# EAGLE design AVR-Stick-v12 (EAGLE 5.10)
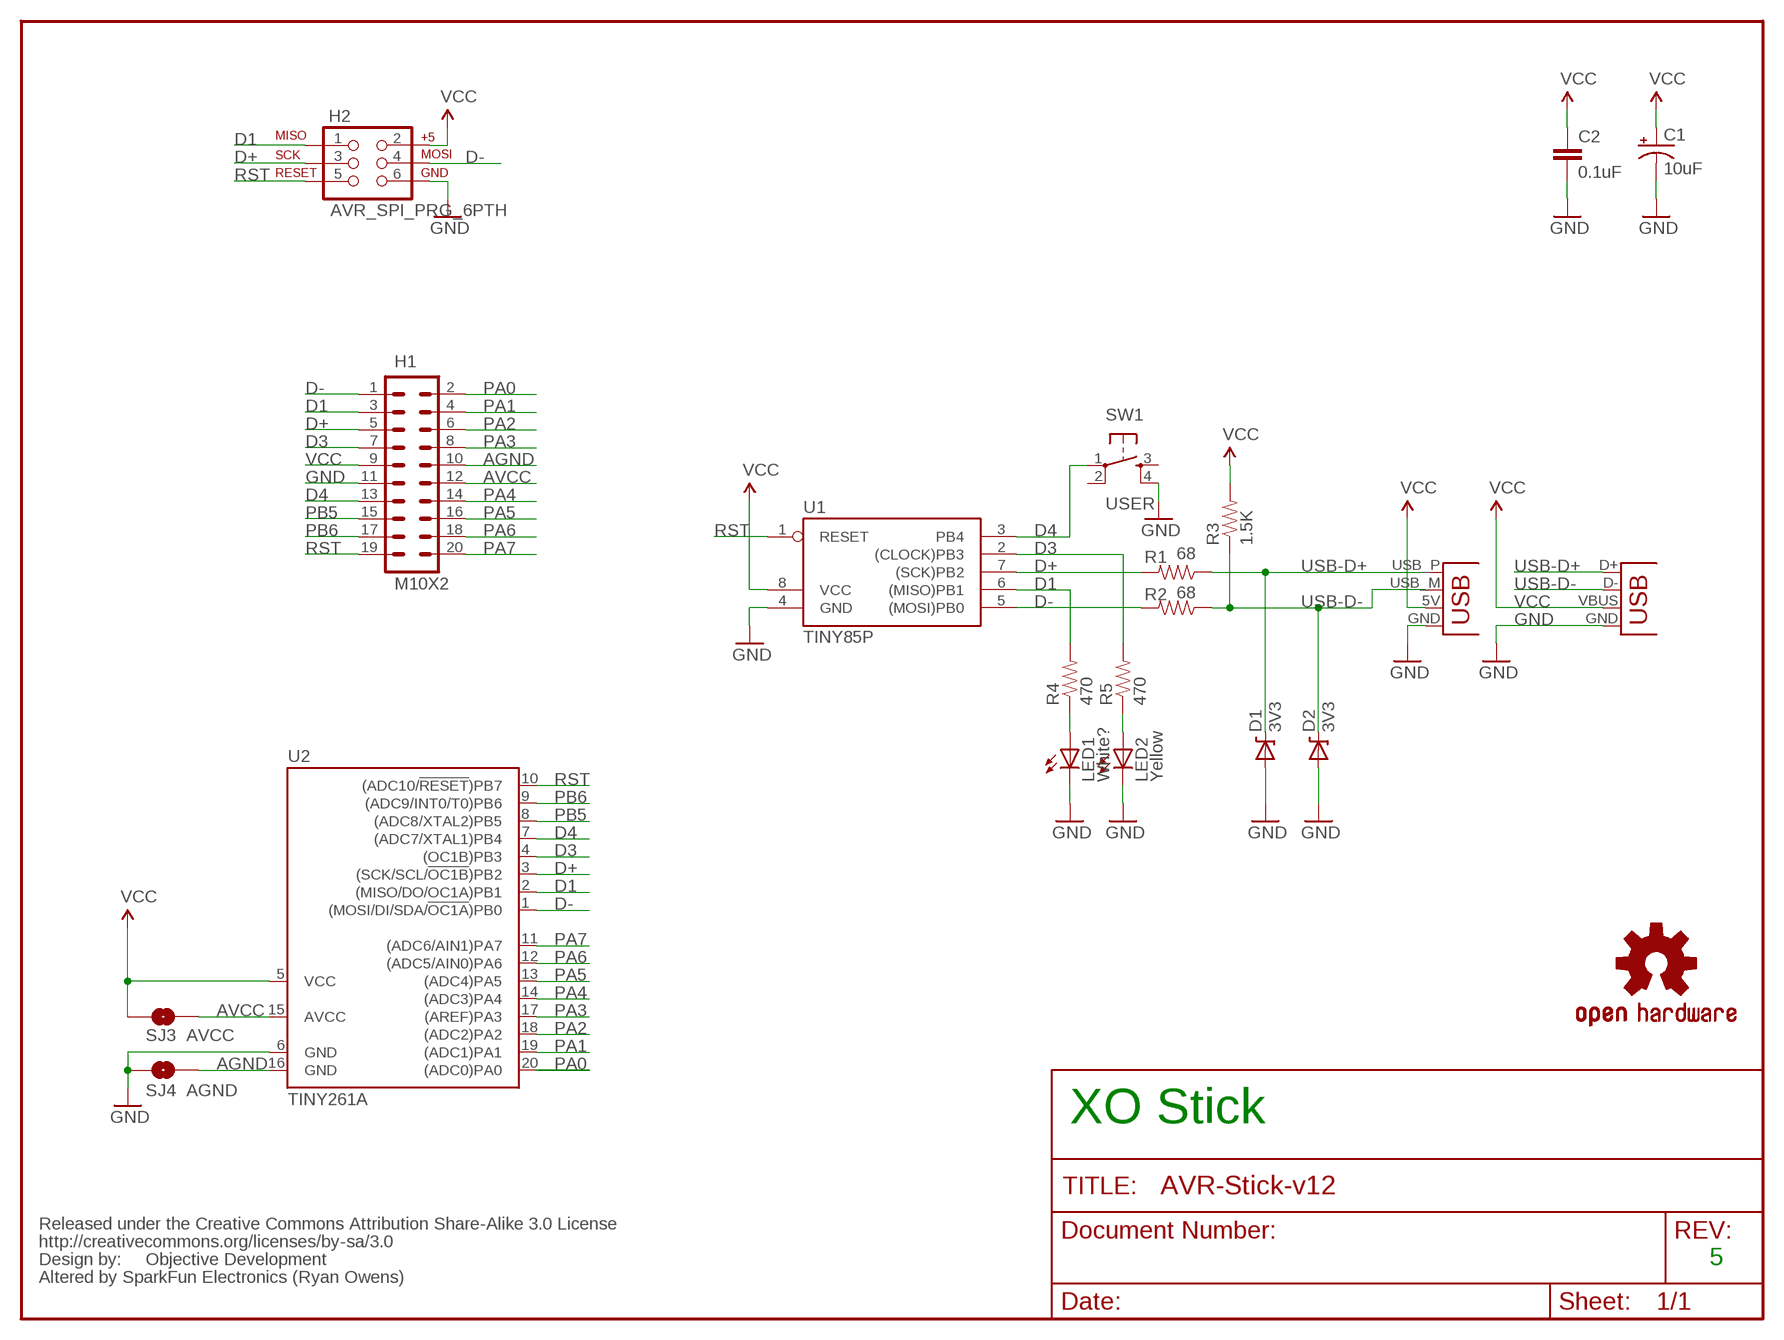
[diagram p0: schematic, sheet 1]

## Parts
C1  10uF  CAP_POLPTH2  [CPOL-RADIAL-10UF-25V]
C2  0.1uF  CAPPTH  [CAP-PTH-SMALL]
D1  3V3  DIODE-ZENERPTH  [DIODE-ZENER]
D2  3V3  DIODE-ZENERPTH  [DIODE-ZENER]
H1  M10X2  [2X10]
H2  AVR_SPI_PRG_6PTH  [2X3]
LED1  White?  LED3MM  [LED3MM]
LED2  Yellow  LED3MM  [LED3MM]
R1  68  RESISTORAXIAL-0.3  [AXIAL-0.3]
R2  68  RESISTORAXIAL-0.3  [AXIAL-0.3]
R3  1.5K  RESISTORAXIAL-0.3  [AXIAL-0.3]
R4  470  RESISTORAXIAL-0.3  [AXIAL-0.3]
R5  470  RESISTORAXIAL-0.3  [AXIAL-0.3]
SJ3  AVCC  SOLDERJUMPERTRACE  [SJ_2S-TRACE]
SJ4  AGND  SOLDERJUMPERTRACE  [SJ_2S-TRACE]
SW1  USER  TAC_SWITCHPTH  [TACTILE-PTH]
U1  TINY85P  [DIL08]
U2  TINY261A  TINY26LP  [DIL20]
U$1  OSHW-LOGOM  [OSHW-LOGO-M]
U$4  CREATIVE_COMMONS  [CREATIVE_COMMONS]
X1  USBPCB  [USB-A-PCB]
X2  USBPTH  [USB-B-PTH]

## Nets
AGND: H1.10 SJ4.2 U2.16(GND)
AVCC: H1.12 SJ3.2 U2.15(AVCC)
D1: H1.3 H2.1 R4.P$2 U1.6((MISO)PB1) U2.2((MISO/DO/OC1A)PB1)
D3: H1.7 R5.P$2 U1.2((CLOCK)PB3) U2.4((OC1B)PB3)
D4: H1.13 SW1.1 U1.3(PB4) U2.7((ADC7/XTAL1)PB4)
D+: H1.5 H2.3 R1.P$2 U1.7((SCK)PB2) U2.3((SCK/SCL/!OC1B!)PB2)
D-: H1.1 H2.4 R2.P$2 U1.5((MOSI)PB0) U2.1((MOSI/DI/SDA/!OC1A!)PB0)
GND: C1.2(-) C2.2 D1.P$2(A) D2.P$2(A) H1.11 H2.6 LED1.K(C) LED2.K(C) SJ4.1 SW1.4 U1.4(GND) U2.6(GND) X1.GND X2.GND
N$7: LED1.A R4.P$1
N$9: LED2.A R5.P$1
PA0: H1.2 U2.20((ADC0)PA0)
PA1: H1.4 U2.19((ADC1)PA1)
PA2: H1.6 U2.18((ADC2)PA2)
PA3: H1.8 U2.17((AREF)PA3)
PA4: H1.14 U2.14((ADC3)PA4)
PA5: H1.16 U2.13((ADC4)PA5)
PA6: H1.18 U2.12((ADC5/AIN0)PA6)
PA7: H1.20 U2.11((ADC6/AIN1)PA7)
PB5: H1.15 U2.8((ADC8/XTAL2)PB5)
PB6: H1.17 U2.9((ADC9/INT0/T0)PB6)
RST: H1.19 H2.5 U1.1(RESET) U2.10((ADC10/!RESET!)PB7)
USB-D+: D1.P$1(C) R1.P$1 X1.USB_P(D+) X2.D+
USB-D-: D2.P$1(C) R2.P$1 R3.P$1 X1.USB_M(D-) X2.D-
VCC: C1.1(+) C2.1 H1.9 H2.2 R3.P$2 SJ3.1 U1.8(VCC) U2.5(VCC) X1.5V(VBUS) X2.VBUS
Unconnected: SW1.2 SW1.3

## Notes on the sheet
- XO Stick
- Objective Development | 5
- Altered by SparkFun Electronics (Ryan Owens)

## Library data of the parts
C1 = SparkFun:CAP_POL: Capacitor Polarized These are standard SMD and PTH capacitors. Normally 10uF, 47uF, and 100uF in electrolytic and tantalum varieties. Always verify the external diameter of the through hole cap, it varies with capacity, voltage, and manufacturer. The EIA devices should be standard.
C2 = SparkFun:CAP: Capacitor Standard 0603 ceramic capacitor, and 0.1" leaded capacitor.
D1 D2 = SparkFun:DIODE-ZENER: Zener Diode Production Part - 8199 3.4V Zener Voltage
H1 = SparkFun:M10X2: This was SPECIALLY designed to be used with our Graphic LCD Backpack. Be sure you want to use this! It is not only staggered on each line of header holes, but IT IS ALSO offset of the center point of the top and bottom lines by 5 mil. This causes the headers to lock into place on the "standard" footprint on the LCD screen. The extra squares on the tdocu layer are there simply to reference other pins (if you were to actually populate a longer header than ten long - this is what we do with the backpacks).
H2 = SparkFun:AVR_SPI_PRG_6: AVR ISP 6 Pin This is the reduced ISP connector for AVR programming. Common on Arduino. This footprint will take up less PCB space and can be used with a 10-pin to 6-pin adapter such as SKU: BOB-08508
LED1 LED2 = SparkFun:LED: LEDs Standard schematic elements and footprints for 5mm, 3mm, 1206, and 0603 sized LEDs. 5mm - Spark Fun Electronics SKU : COM-00529 (and others)
R1-R5 = SparkFun:RESISTOR: Resistor Basic schematic elements and footprints for 0603, 1206, and PTH resistors.
SJ3 SJ4 = SparkFun:SOLDERJUMPER: Solder Jumper Standard SMD solder jumper. Used to automate production. Two varients : Normally Open and Normally Closed are the same, but have different paste layers. NC will have a large amount of paste and should jumper during reflow.
SW1 = SparkFun:TAC_SWITCH: Momentary Switch Button commonly used for reset or general input. Spark Fun Electronics SKU : COM-00097
U1 = atmel:TINY85: MICROCONTROLLER 1K ROM 128 bytes RAM 128 bytes EEPROM
U2 = atmel:TINY26*: 8-bit AVR Microcontroller with 2K Bytes Flash Source: http://www.atmel.com .. doc1477.pdf
U$1 = SparkFun:OSHW-LOGO: Open Source Hardware Logo This logo indicates the piece of hardware it is found on incorporates a OSHW license and/or adheres to the definition of open source hardware found here: http://freedomdefined.org/OSHW
U$4 = SparkFun:CREATIVE_COMMONS
X1 X2 = SparkFun:USB: USB Connectors USB-B-PTH is fully proven SKU : PRT-00139 USB-miniB is fully proven SKU : PRT-00587 USB-A-PCB is untested. USB-A-H is throughly reviewed, but untested. Spark Fun Electronics SKU : PRT-00437 USB-B-SMT is throughly reviewed, but untested. Needs silkscreen touching up. USB-A-S has not been used/tested USB-MB-H has not been used/tested

## Board
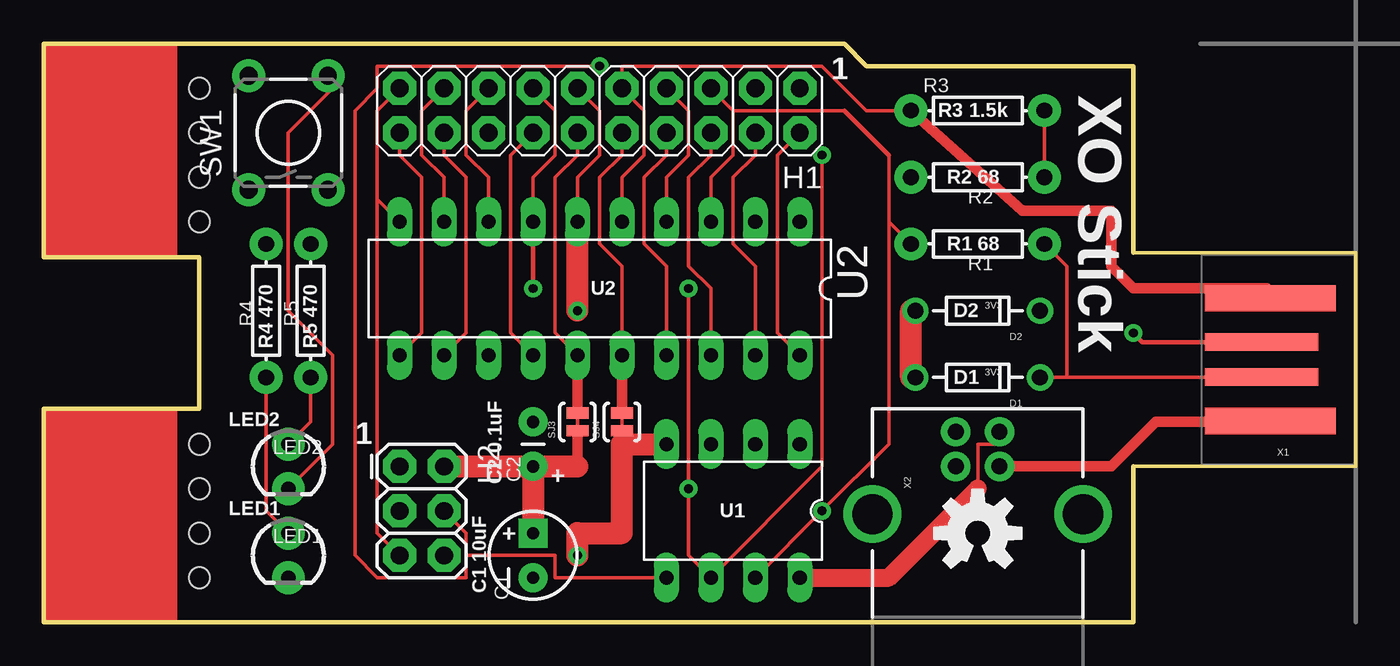
[diagram p1: board, top side]
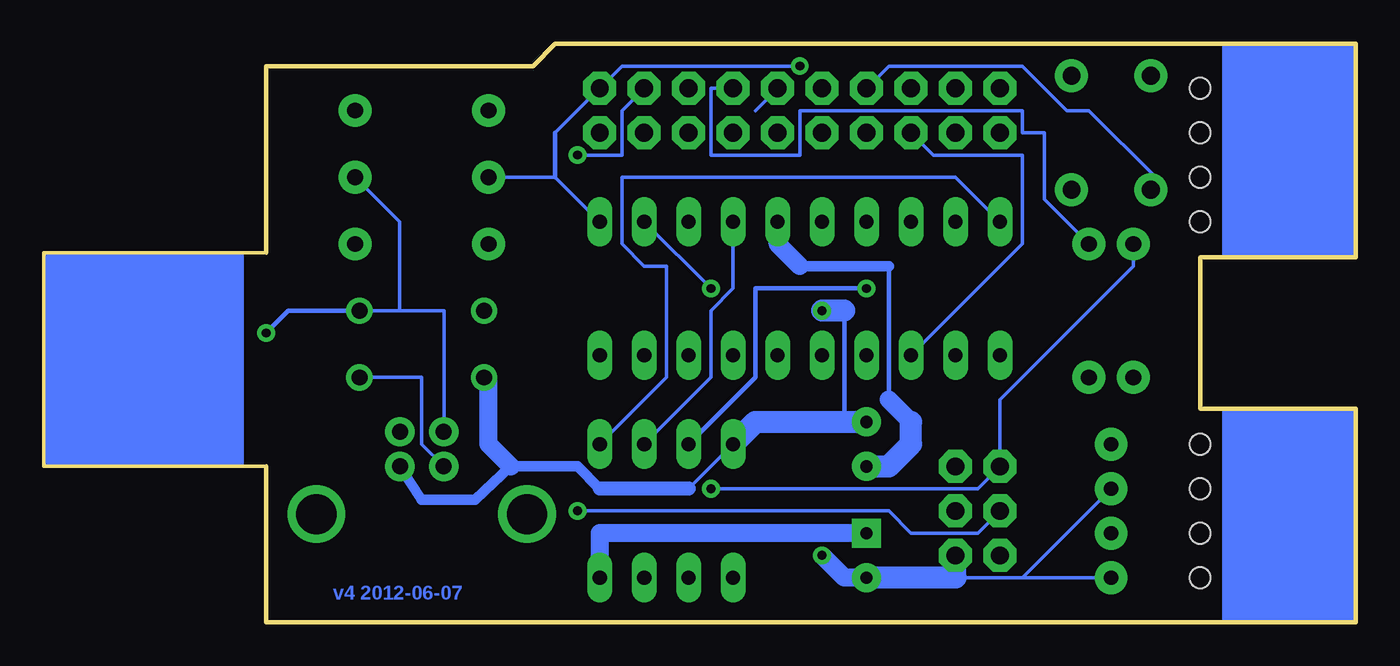
[diagram p2: board, bottom side, seen from below]

Size 74.93 x 33.02 mm. Coordinates in mm from the lower left corner, seen from the top.
Outline: 62.23,8.89 74.93,8.89 74.93,21.08 62.23,21.08 62.23,31.75 46.99,31.75 45.72,33.02 0,33.02 0,20.83 8.89,20.83 8.89,12.19 0,12.19 0,0 62.23,0 62.23,8.89
Copper layers (1*16): Top 0.035mm / dielectric 1.5mm / Bottom 0.035mm
Design rules "SparkFun": minimum track width 8mil, minimum drill 20mil, track to track 8mil, track to pad 8mil, pad to pad 8mil, via to via 8mil, smd to smd 8mil, copper to edge 10mil, drill to drill 8mil, minimum pad ring 12mil, minimum via ring 10mil, stop-mask expansion 4mil, vias tented up to drill 25mil, thermal gap 10mil
Holes 1.2 mm at 8.89,30.48 8.89,27.94 8.89,22.86 8.89,10.16 8.89,7.62 8.89,5.08 8.89,2.54 8.89,25.4

### Footprints (pad centres in the part's own frame; a part is rotated, then mirrored left to right if it is on the bottom)
CPOL-RADIAL-10UF-25V = drill 0.7 pad 1.651 square: 1 1.27,0 | drill 0.7 pad 1.651 round: 2 -1.27,0
CAP-PTH-SMALL = drill 0.7 pad 1.651 round: 1 0,0; 2 2.54,0
DIODE-ZENER = drill 0.9 round: P$1 -3.556,0; P$2 3.556,0
2X10 = drill 1.016 pad 1.88 octagon: 1 -11.43,-1.27; 2 -11.43,1.27; 3 -8.89,-1.27; 4 -8.89,1.27; 5 -6.35,-1.27; 6 -6.35,1.27; 7 -3.81,-1.27; 8 -3.81,1.27; 9 -1.27,-1.27; 10 -1.27,1.27; 11 1.27,-1.27; 12 1.27,1.27; 13 3.81,-1.27; 14 3.81,1.27; 15 6.35,-1.27; 16 6.35,1.27; 17 8.89,-1.27; 18 8.89,1.27; 19 11.43,-1.27; 20 11.43,1.27
2X3 = drill 1.016 pad 1.88 octagon: 1 0,0; 2 0,2.54; 3 2.54,0; 4 2.54,2.54; 5 5.08,0; 6 5.08,2.54
LED3MM = drill 0.813 pad 1.88 round: A -1.27,0; K 1.27,0
AXIAL-0.3 = drill 0.9 pad 1.88 round: P$1 -3.81,0; P$2 3.81,0
SJ_2S-TRACE = smd 0.635 x 1.27: 1 -0.508,0; 2 0.508,0
TACTILE-PTH = drill 1.016 pad 1.88 round: 1 -3.251,2.261; 2 3.251,2.261; 3 -3.251,-2.261; 4 3.251,-2.261
DIL08 = drill 0.813 long: 1 -3.81,-3.81; 2 -1.27,-3.81; 3 1.27,-3.81; 4 3.81,-3.81; 5 3.81,3.81; 6 1.27,3.81; 7 -1.27,3.81; 8 -3.81,3.81
DIL20 = drill 0.813 long: 1 -11.43,-3.81; 2 -8.89,-3.81; 3 -6.35,-3.81; 4 -3.81,-3.81; 5 -1.27,-3.81; 6 1.27,-3.81; 7 3.81,-3.81; 8 6.35,-3.81; 9 8.89,-3.81; 10 11.43,-3.81; 11 11.43,3.81; 12 8.89,3.81; 13 6.35,3.81; 14 3.81,3.81; 15 1.27,3.81; 16 -1.27,3.81; 17 -3.81,3.81; 18 -6.35,3.81; 19 -8.89,3.81; 20 -11.43,3.81
USB-A-PCB = smd 7.5 x 1.5: 5V -0.2,-3.5; GND -0.2,3.5 | smd 6.5 x 1: USB_M 0.3,-1; USB_P 0.3,1
USB-B-PTH = drill 0.914 pad 1.676 round: D+ 0,1.25; D- 1.981,1.25; GND 0,-1.25; VBUS 1.981,-1.25 | drill 2.286 round: S1 -2.718,-6.02; S2 -2.718,6.02

### Placement (x,y rotation side)
C1  27.94,3.81 90 top
C2  27.94,8.89 90 top
D1  53.34,13.97 180 top
D2  53.34,17.78 180 top
H1  31.75,29.21 180 top
H2  20.32,8.89 270 top
LED1  13.97,3.81 270 top
LED2  13.97,8.89 270 top
R1  53.34,21.59 180 top
R2  53.34,25.4 180 top
R3  53.34,29.21 180 top
R4  12.7,17.78 90 top
R5  15.24,17.78 90 top
SJ3  30.48,11.43 90 top
SJ4  33.02,11.43 90 top
SW1  13.97,27.94 90 top
U1  39.37,6.35 180 top
U2  31.75,19.05 180 top
U$1  53.34,5.08 0 top
U$4  20.32,-10.16 0 top  (outside the outline)
X1  69.85,14.99 180 top
X2  53.34,8.89 90 top

### Tracks (layer width: path | path; a pad name or v marks a point on that pad's centre or on a via)
AGND
  Top 0.203: U2.16 33.02,20.32 31.75,21.59 31.75,25.4 33.02,26.67 H1.10
  Top 0.61: SJ4.2 U2.16
AVCC
  Top 0.203: U2.15 29.21,16.51 29.21,25.4 30.48,26.67 H1.12
  Top 0.61: SJ3.2 U2.15
D1  (via drill 0.51)
  Top 0.203: v36.83,19.05 v36.83,7.62 36.83,3.81 U1.6 44.45,8.89 v44.45,26.67
  Bottom 0.203: R4.P$2 12.7,20.32 20.32,12.7 H2.1 21.59,7.62 v36.83,7.62 | v36.83,19.05 U2.2 | H1.3 41.91,29.21 41.91,26.67 v44.45,26.67
D3
  Top 0.203: U2.4 35.56,25.4 36.83,26.67 36.83,29.21 H1.7
  Bottom 0.203: U1.2 36.83,13.97 36.83,17.78 35.56,19.05 U2.4 | H1.7 36.83,30.48 36.83,26.67 31.75,26.67 31.75,29.21 19.05,29.21 19.05,27.94 17.78,27.94 17.78,24.13 R5.P$2
D4  (via drill 0.51)
  Top 0.203: U2.7 27.94,25.4 29.21,26.67 29.21,29.21 H1.13
  Top 0.254: U2.7 v27.94,19.05
  Bottom 0.203: H1.13 26.67,31.75 19.05,31.75 16.51,29.21 15.24,29.21 11.43,25.4 SW1.1
  Bottom 0.254: U1.3 34.29,13.97 34.29,19.05 v27.94,19.05
D+  (via drill 0.51)
  Top 0.203: U2.3 38.1,25.4 39.37,26.67 39.37,29.21 | 39.37,29.21 H1.5 | 48.26,22.86 48.26,26.67 | 45.72,29.21 39.37,29.21 | 48.26,22.86 R1.P$2 | U1.7 v44.45,6.35 48.26,10.16 48.26,22.86
  Top 0.254: 48.26,26.67 45.72,29.21
  Bottom 0.203: H2.3 21.59,5.08 25.4,5.08 26.67,6.35 v44.45,6.35
D-  (via drill 0.51)
  Top 0.203: U1.5 29.21,2.54 29.21,3.81 24.13,3.81 | 24.13,3.81 24.13,5.08 H2.4 | v31.75,31.75 19.05,31.75 19.05,30.48 17.78,29.21 17.78,3.81 19.05,2.54 24.13,2.54 24.13,3.81
  Bottom 0.203: U2.1 45.72,25.4 R2.P$2 | 45.72,27.94 H1.1 41.91,31.75 v31.75,31.75
  Bottom 0.254: 45.72,27.94 45.72,25.4
GND  (via drill 0.51)
  Top 0.203: U2.6 30.48,25.4 31.75,26.67 31.75,29.21 H1.11 | LED2.K 16.51,10.16 16.51,15.24 13.97,17.78 13.97,27.94 16.51,30.48 SW1.4 | 69.85,11.43 X1.GND | D1.P$2 49.53,13.97 | 49.53,17.78 D2.P$2
  Top 0.254: 33.02,10.16 SJ4.1
  Top 0.61: 69.85,11.43 63.5,11.43 60.96,8.89 X2.GND
  Top 1.27: U1.4 33.02,10.16 33.02,5.08 30.48,5.08 v30.48,3.81 | 49.53,13.97 49.53,17.78 | v30.48,17.78 U2.6
  Bottom 0.203: 19.05,2.54 22.86,2.54 | LED1.K 19.05,2.54 | 19.05,2.54 LED2.K | U1.4 38.1,7.62 | 54.61,8.89 X2.GND | 49.53,13.97 D1.P$2
  Bottom 0.254: 29.21,11.43 29.21,17.78
  Bottom 0.61: 54.61,8.89 53.34,6.99 50.29,6.99 48.26,8.89 44.45,8.89 43.18,7.62
  Bottom 0.813: 38.1,7.62 43.18,7.62
  Bottom 1.016: v30.48,3.81 29.21,2.54 C1.2 | 48.26,8.89 49.53,10.16 49.53,13.97
  Bottom 1.27: C1.2 22.86,2.54 H2.6 | C2.2 29.21,11.43 34.29,11.43 U1.4 | 29.21,17.78 v30.48,17.78
N$7
  Top 0.203: LED1.A 12.7,6.35 R4.P$1
N$9
  Top 0.203: LED2.A 15.24,11.43 R5.P$1
PA0
  Top 0.203: U2.20 41.91,16.51 41.91,26.67 H1.2
PA1
  Top 0.203: U2.19 40.64,20.32 39.37,21.59 39.37,25.4 40.64,26.67 H1.4
PA2
  Top 0.203: U2.18 38.1,19.05 36.83,20.32 36.83,25.4 38.1,26.67 H1.6
PA3
  Top 0.203: U2.17 35.56,20.32 34.29,21.59 34.29,25.4 35.56,26.67 H1.8
PA4
  Top 0.203: U2.14 26.67,16.51 26.67,26.67 H1.14
PA5
  Bottom 0.203: U2.13 19.05,21.59 19.05,26.67 24.13,26.67 H1.16
PA6
  Top 0.203: U2.12 24.13,16.51 24.13,25.4 22.86,26.67 H1.18
PA7
  Top 0.203: U2.11 21.59,16.51 21.59,25.4 20.32,26.67 H1.20
PB5
  Top 0.203: U2.8 25.4,25.4 24.13,26.67 24.13,29.21 H1.15
PB6
  Top 0.203: U2.9 22.86,25.4 21.59,26.67 21.59,29.21 H1.17
RST
  Top 0.203: 19.05,24.13 U2.10 | 19.05,24.13 19.05,29.21 H1.19 | H2.5 19.05,5.08 19.05,24.13
  Bottom 0.203: U1.1 39.37,13.97 39.37,20.32 40.64,20.32 41.91,21.59 41.91,25.4 22.86,25.4 U2.10
USB-D+
  Top 0.203: D1.P$1 58.42,13.97 | 58.42,13.97 68.58,13.97 X1.USB_P | R1.P$1 58.42,20.32 58.42,13.97
  Bottom 0.203: X2.D+ 52.07,8.89 53.34,10.16 53.34,13.97 D1.P$1 57.15,13.97
USB-D-  (via drill 0.51)
  Top 0.203: R2.P$1 R3.P$1
  Top 0.254: X1.USB_M 62.75,15.99 v62.23,16.51
  Bottom 0.203: 54.61,17.78 52.07,17.78 52.07,11.43 X2.D- | 54.61,17.78 D2.P$1 | R2.P$1 54.61,22.86 54.61,17.78
  Bottom 0.254: v62.23,16.51 60.96,17.78 D2.P$1
VCC
  Top 0.203: U2.5 33.02,25.4 34.29,26.67 34.29,29.21 H1.9 33.02,31.75 44.45,31.75 46.99,29.21 R3.P$2 | 53.34,7.62 53.34,10.16 54.61,10.16 X2.VBUS | 69.85,19.05 X1.5V
  Top 0.61: 30.48,8.89 SJ3.1 | R3.P$2 55.88,23.5 60.96,23.5 60.96,20.32 62.23,19.05 69.85,19.05
  Top 1.016: 53.34,7.62 48.26,2.54 U1.8
  Top 1.27: C2.1 30.48,8.89 | C2.1 C1.1 | H2.2 C2.1
  Bottom 0.203: H1.9 34.29,29.21
  Bottom 0.254: 26.67,12.7 26.67,20.32
  Bottom 0.61: 26.67,20.32 31.75,20.32
  Bottom 1.016: U1.8 43.18,5.08 C1.1 | 25.4,11.43 26.67,12.7 | 31.75,20.32 33.02,21.59 U2.5
  Bottom 1.27: C2.1 26.67,8.89 25.4,10.16 25.4,11.43
(copper drawn outside any net)
  shapes: Bottom area x3, Top area x2

### Text on the board
Bottom: v4 2012-06-07
tPlace: 1 | XO Stick | R3 1.5k | R2 68 | R1 68 | U2 | D2 | R4 470 | R5 470 | D1 | LED2 | 1 | C2 0.1uF | + | LED1 | U1 | + | C1 10uF
tValues: Objective Development | Altered by SparkFun Electronics (Ryan Owens) | Altered by C. Scott Ananian for OLPC